# EAGLE design I2CMux (EAGLE 7.4.0)
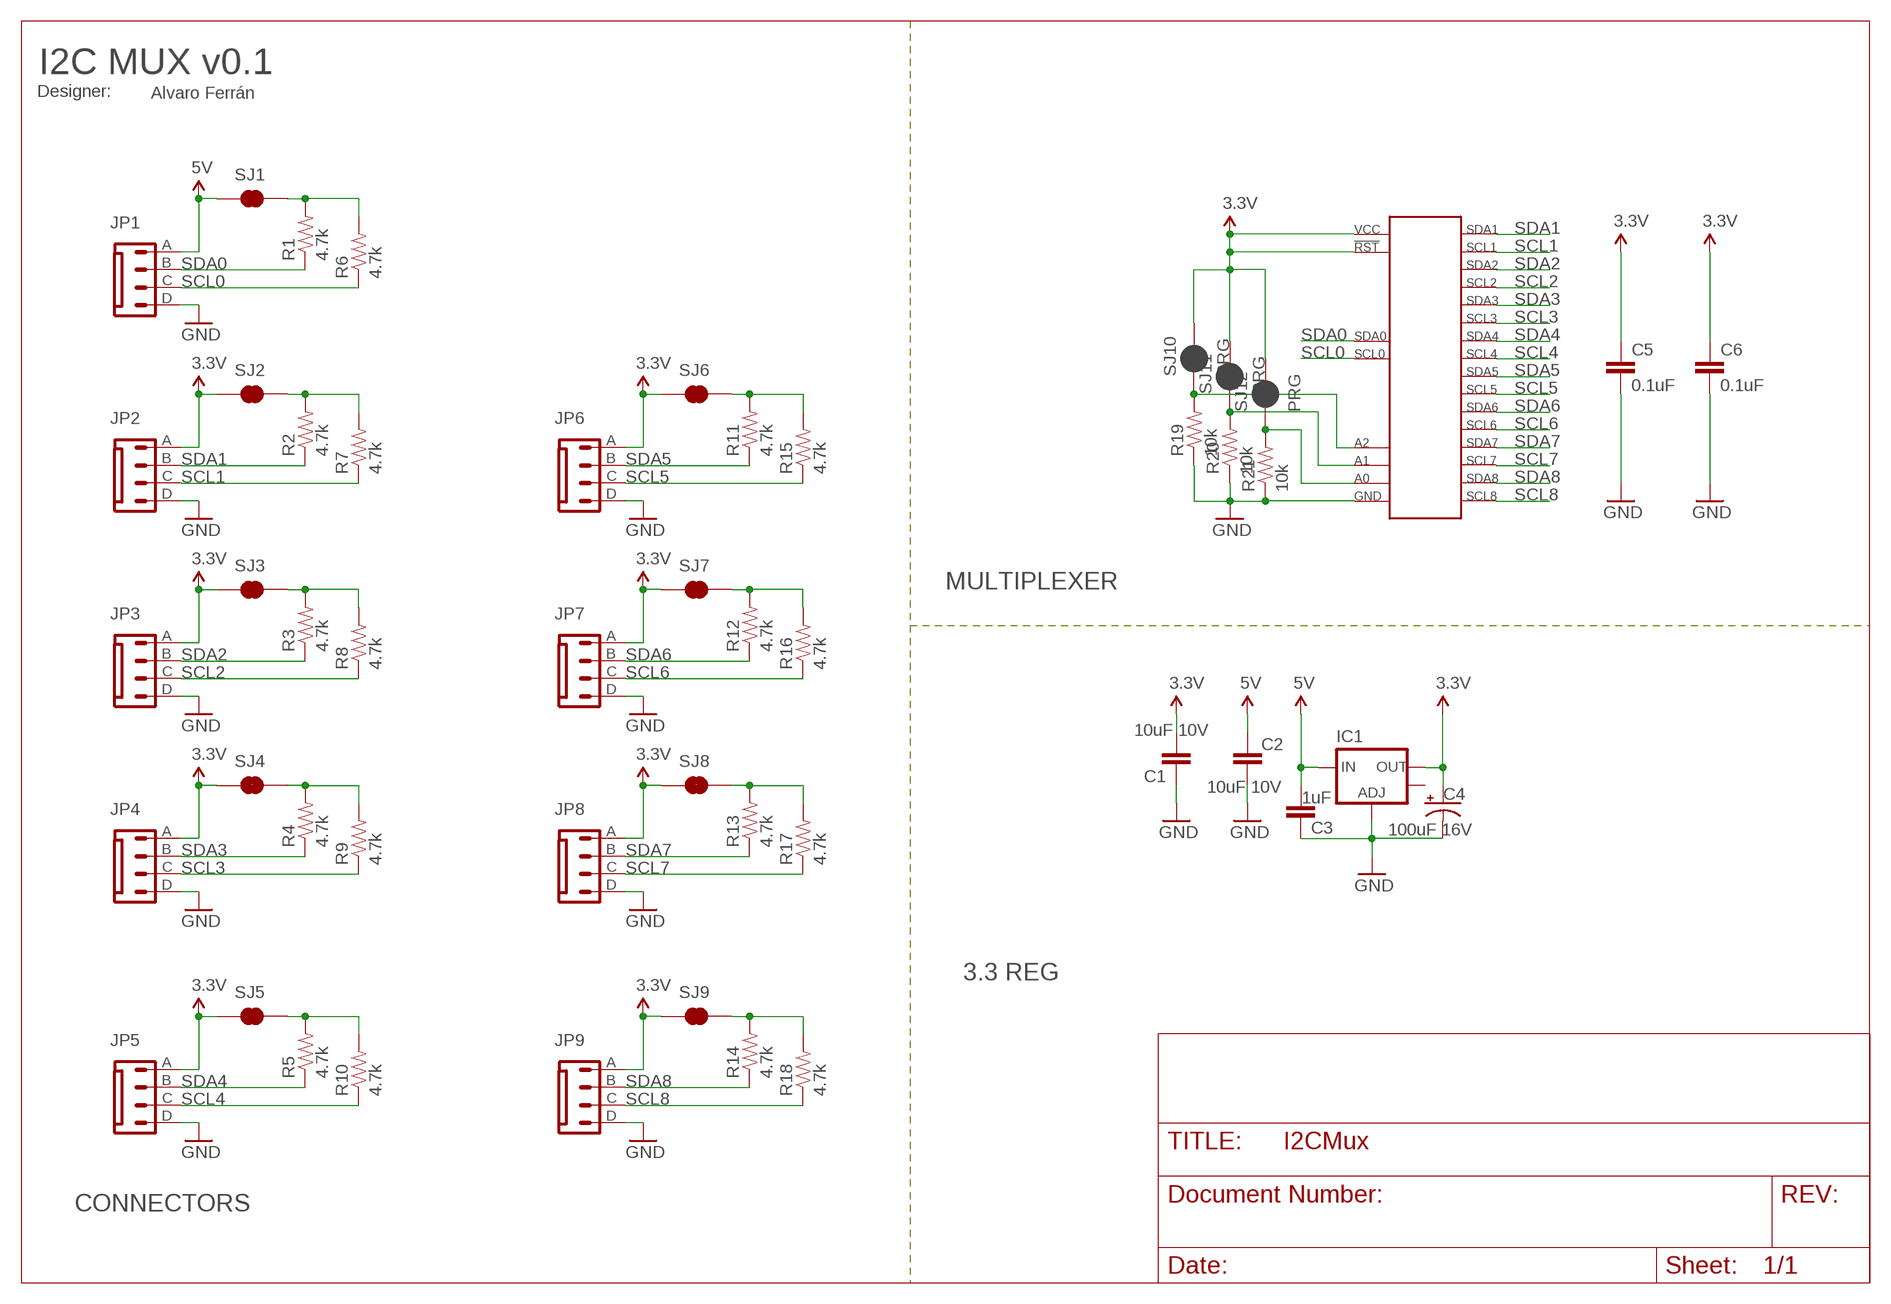
[diagram p0: schematic, sheet 1]

## Parts
C1  10uF 10V  CAP0402-CAP  [0402-CAP]
C2  10uF 10V  CAP0402-CAP  [0402-CAP]
C3  1uF  CAP0402-CAP  [0402-CAP]
C4  100uF 16V  CAP_POLC  [PANASONIC_C]
C5  0.1uF  CAP0402-CAP  [0402-CAP]
C6  0.1uF  CAP0402-CAP  [0402-CAP]
IC1  V_REG_LM1117SOT223  [SOT223]
IC2  PCA9548A  [PCA9548ABS]
JP1  MX-6410-04A  [MX-6410-04A]
JP2  MX-6410-04A  [MX-6410-04A]
JP3  MX-6410-04A  [MX-6410-04A]
JP4  MX-6410-04A  [MX-6410-04A]
JP5  MX-6410-04A  [MX-6410-04A]
JP6  MX-6410-04A  [MX-6410-04A]
JP7  MX-6410-04A  [MX-6410-04A]
JP8  MX-6410-04A  [MX-6410-04A]
JP9  MX-6410-04A  [MX-6410-04A]
R1  4.7k  RESISTOR0402-RES  [0402-RES]
R2  4.7k  RESISTOR0402-RES  [0402-RES]
R3  4.7k  RESISTOR0402-RES  [0402-RES]
R4  4.7k  RESISTOR0402-RES  [0402-RES]
R5  4.7k  RESISTOR0402-RES  [0402-RES]
R6  4.7k  RESISTOR0402-RES  [0402-RES]
R7  4.7k  RESISTOR0402-RES  [0402-RES]
R8  4.7k  RESISTOR0402-RES  [0402-RES]
R9  4.7k  RESISTOR0402-RES  [0402-RES]
R10  4.7k  RESISTOR0402-RES  [0402-RES]
R11  4.7k  RESISTOR0402-RES  [0402-RES]
R12  4.7k  RESISTOR0402-RES  [0402-RES]
R13  4.7k  RESISTOR0402-RES  [0402-RES]
R14  4.7k  RESISTOR0402-RES  [0402-RES]
R15  4.7k  RESISTOR0402-RES  [0402-RES]
R16  4.7k  RESISTOR0402-RES  [0402-RES]
R17  4.7k  RESISTOR0402-RES  [0402-RES]
R18  4.7k  RESISTOR0402-RES  [0402-RES]
R19  10k  RESISTOR0402-RES  [0402-RES]
R20  10k  RESISTOR0402-RES  [0402-RES]
R21  10k  RESISTOR0402-RES  [0402-RES]
SJ1  JUMPER-PAD-2-NC_BY_TRACE  [PAD-JUMPER-2-NC_BY_TRACE_YES_SILK]
SJ2  JUMPER-PAD-2-NC_BY_TRACE  [PAD-JUMPER-2-NC_BY_TRACE_YES_SILK]
SJ3  JUMPER-PAD-2-NC_BY_TRACE  [PAD-JUMPER-2-NC_BY_TRACE_YES_SILK]
SJ4  JUMPER-PAD-2-NC_BY_TRACE  [PAD-JUMPER-2-NC_BY_TRACE_YES_SILK]
SJ5  JUMPER-PAD-2-NC_BY_TRACE  [PAD-JUMPER-2-NC_BY_TRACE_YES_SILK]
SJ6  JUMPER-PAD-2-NC_BY_TRACE  [PAD-JUMPER-2-NC_BY_TRACE_YES_SILK]
SJ7  JUMPER-PAD-2-NC_BY_TRACE  [PAD-JUMPER-2-NC_BY_TRACE_YES_SILK]
SJ8  JUMPER-PAD-2-NC_BY_TRACE  [PAD-JUMPER-2-NC_BY_TRACE_YES_SILK]
SJ9  JUMPER-PAD-2-NC_BY_TRACE  [PAD-JUMPER-2-NC_BY_TRACE_YES_SILK]
SJ10  PRG  JUMPER-PAD-2-NC_BY_PASTE  [PAD-JUMPER-2-NC_BY_PASTE_YES_SILK]
SJ11  PRG  JUMPER-PAD-2-NC_BY_PASTE  [PAD-JUMPER-2-NC_BY_PASTE_YES_SILK]
SJ12  PRG  JUMPER-PAD-2-NC_BY_PASTE  [PAD-JUMPER-2-NC_BY_PASTE_YES_SILK]

## Nets
3.3V [power]: C1.2 C4.+ C5.1 C6.1 IC1.2(OUT) IC2.21(VCC) IC2.24(!RESET) JP2.A JP3.A JP4.A JP5.A JP6.A JP7.A JP8.A JP9.A SJ2.1 SJ3.1 SJ4.1 SJ5.1 SJ6.1 SJ7.1 SJ8.1 SJ9.1 SJ10.2 SJ11.2 SJ12.2
5V: C2.2 C3.2 IC1.3(IN) JP1.A SJ1.1
A0: IC2.22(A0) R21.2 SJ12.1
A1: IC2.23(A1) R20.2 SJ11.1
A2: IC2.18(A2) R19.2 SJ10.1
GND: C1.1 C2.1 C3.1 C4.- C5.2 C6.2 IC1.1(ADJ) IC2.9(GND) IC2.THERMAL(GND) JP1.D JP2.D JP3.D JP4.D JP5.D JP6.D JP7.D JP8.D JP9.D R19.1 R20.1 R21.1
N$2: R1.2 R6.2 SJ1.2
N$5 [power]: R2.2 R7.2 SJ2.2
N$6 [power]: R3.2 R8.2 SJ3.2
N$7 [power]: R4.2 R9.2 SJ4.2
N$8 [power]: R5.2 R10.2 SJ5.2
N$9 [power]: R14.2 R18.2 SJ9.2
N$10 [power]: R13.2 R17.2 SJ8.2
N$11 [power]: R12.2 R16.2 SJ7.2
N$12 [power]: R11.2 R15.2 SJ6.2
SCL0: IC2.19(SCL0) JP1.C R6.1
SCL1: IC2.2(SCL1) JP2.C R7.1
SCL2: IC2.4(SCL2) JP3.C R8.1
SCL3: IC2.6(SCL3) JP4.C R9.1
SCL4: IC2.8(SCL4) JP5.C R10.1
SCL5: IC2.11(SCL5) JP6.C R15.1
SCL6: IC2.13(SCL6) JP7.C R16.1
SCL7: IC2.15(SCL7) JP8.C R17.1
SCL8: IC2.17(SCL8) JP9.C R18.1
SDA0: IC2.20(SDA0) JP1.B R1.1
SDA1: IC2.1(SDA1) JP2.B R2.1
SDA2: IC2.3(SDA2) JP3.B R3.1
SDA3: IC2.5(SDA3) JP4.B R4.1
SDA4: IC2.7(SDA4) JP5.B R5.1
SDA5: IC2.10(SDA5) JP6.B R11.1
SDA6: IC2.12(SDA6) JP7.B R12.1
SDA7: IC2.14(SDA7) JP8.B R13.1
SDA8: IC2.16(SDA8) JP9.B R14.1
Unconnected: IC1.4(OUT)

## Notes on the sheet
- I2C MUX v0.1
- Designer: | Alvaro Ferrán
- MULTIPLEXER
- 3.3 REG
- CONNECTORS

## Library data of the parts
C1-C3 C5 C6 = SparkFun-Passives:CAP: Capacitor Standard 0603 ceramic capacitor, and 0.1" leaded capacitor.
C4 = SparkFun-Capacitors:CAP_POL: Capacitor Polarized These are standard SMD and PTH capacitors. Normally 10uF, 47uF, and 100uF in electrolytic and tantalum varieties. Always verify the external diameter of the through hole cap, it varies with capacity, voltage, and manufacturer. The EIA devices should be standard.
IC1 = SparkFun-PowerIC:V_REG_LM1117: Voltage Regulator LM1117 Standard adjustable voltage regulator but in SMD form. Spark Fun Electronics SKU : COM-00595; PROD_ID: VREG-08170
IC2 = alvaroferran:PCA9548A: 8-channel I2C-bus switch multiplexer with reset
JP1-JP9 = alvaroferran:MX-6410-04A: Locking molex connector ( http://www.tme.eu/en/details/mx-6410-04a/raster-signal-connectors-254mm/molex/0022272041-ae-6410-04a102/ )
R1-R21 = SparkFun-Passives:RESISTOR: Resistor Basic schematic elements and footprints for 0603, 1206, and PTH resistors.
SJ1-SJ9 = SparkFun-Passives:JUMPER-PAD-2-NC_BY_TRACE
SJ10-SJ12 = SparkFun-Passives:JUMPER-PAD-2-NC_BY_PASTE

## Net classes
0 default: width 0.254 mm, drill 0.254 mm, clearance 0.203 mm
1 power: width 0.61 mm, drill 0.61 mm, clearance 0.254 mm
2 gnd: width 0.305 mm, drill 0.559 mm, clearance 0.254 mm

## Board
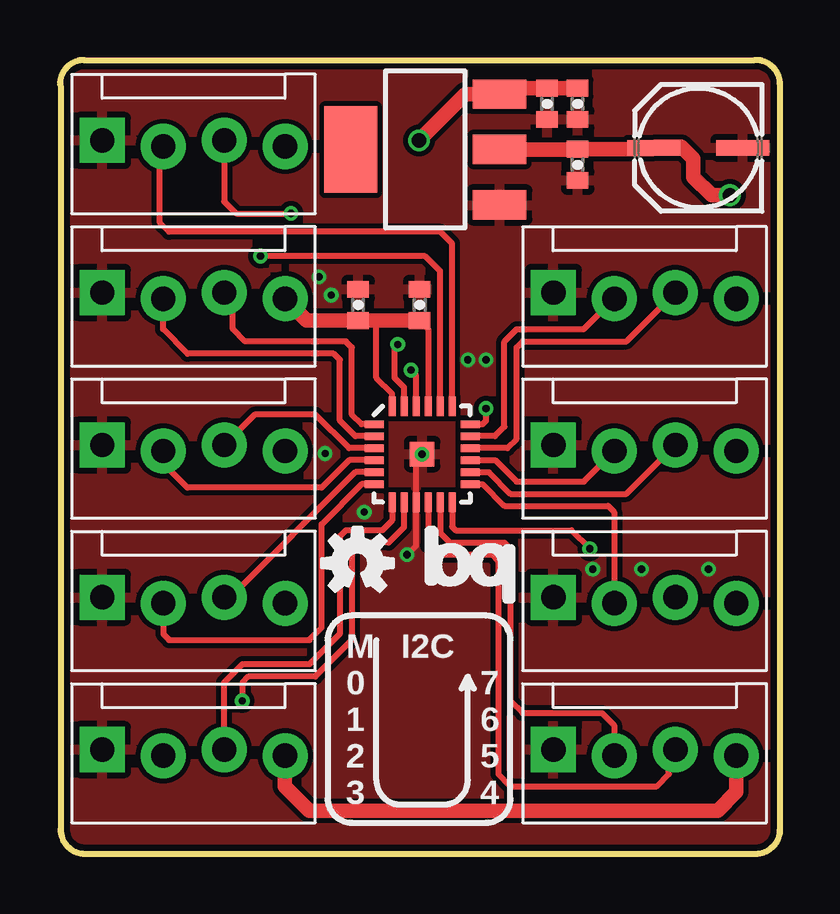
[diagram p1: board, top side]
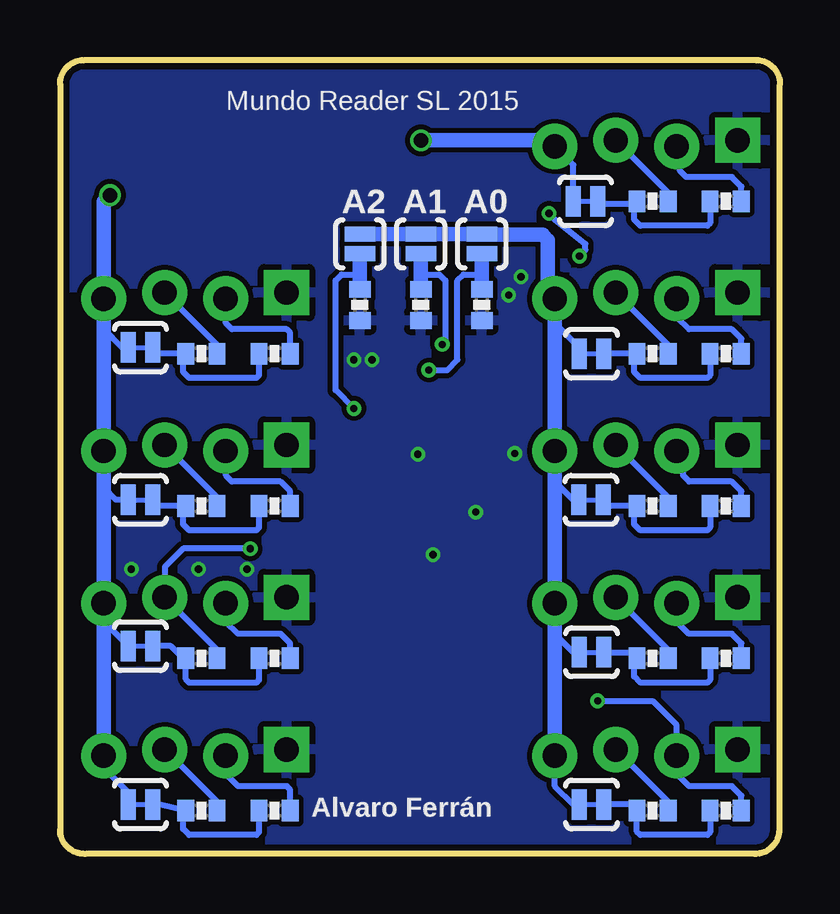
[diagram p2: board, bottom side, seen from below]

Size 30 x 33.1 mm. Coordinates in mm from the lower left corner, seen from the top.
Outline: 1.02,33.1 arc90 0,32.08
Outline: 30,32.08 arc90 28.98,33.1
Outline: 0.03,1.02 arc90 1.04,0
Outline: 28.98,0 arc90 30,1.02
Outline: 0.99,33.1 28.93,33.1
Outline: 0.03,32.03 0.03,1.04
Outline: 0.99,0 28.93,0
Outline: 30,32.11 30,0.86
Copper layers (1*16): Top 0.035mm / dielectric 1.5mm / Bottom 0.035mm
Design rules "pighixxx_CAM_DRC_V1.0": minimum track width 6mil, minimum drill 12mil, track to track 6mil, track to pad 6mil, pad to pad 6mil, via to via 6mil, smd to smd 0mil, copper to edge 10mil, drill to drill 10mil, minimum pad ring 10mil, minimum via ring 6mil, stop-mask expansion 2mil, vias tented up to drill 100mil, thermal gap 10mil

### Footprints (pad centres in the part's own frame; a part is rotated, then mirrored left to right if it is on the bottom)
0402-CAP = smd 0.7 x 0.9: 1 -0.65,0; 2 0.65,0
PANASONIC_C = smd 2.2 x 0.65: + 1.9,-0.2; - -1.8,-0.2
SOT223 = smd 1.219 x 2.235: 1 -2.311,-3.099; 2 0,-3.099; 3 2.311,-3.099 | smd 3.6 x 2.2: 4 0,3.099
PCA9548ABS = smd 0.8 x 0.3: 1 -2,1.25; 2 -2,0.75; 3 -2,0.25; 4 -2,-0.25; 5 -2,-0.75; 6 -2,-1.25; 13 2,-1.25; 14 2,-0.75; 15 2,-0.25; 16 2,0.25; 17 2,0.75; 18 2,1.25 | smd 0.3 x 0.8: 7 -1.25,-2; 8 -0.75,-2; 9 -0.25,-2; 10 0.25,-2; 11 0.75,-2; 12 1.25,-2; 19 1.25,2; 20 0.75,2; 21 0.25,2; 22 -0.25,2; 23 -0.75,2; 24 -1.25,2 | smd 1.016 x 1.016: THERMAL 0,0
MX-6410-04A = drill 1.016 pad 1.88: A 8.9,2.797; B 6.36,3.051; C 3.82,2.797 | drill 1.016 pad 1.88 square: D 1.28,3.051
0402-RES = smd 0.7 x 0.9: 1 -0.65,0; 2 0.65,0
PAD-JUMPER-2-NC_BY_TRACE_YES_SILK = smd 0.635 x 1.27: 1 -0.508,0; 2 0.508,0
PAD-JUMPER-2-NC_BY_PASTE_YES_SILK = smd 0.635 x 1.27: 1 -0.401,0; 2 0.413,0

### Placement (x,y rotation side)
C1  21.56,28.73 90 top
C2  21.56,31.27 90 top
C3  20.29,31.27 90 top
C4  26.64,29.24 180 top
C5  12.42,22.89 90 top
C6  14.99,22.89 90 top
IC1  15.21,29.36 90 top
IC2  15.09,16.66 0 top
JP1  0.48,26.7 0 top
JP2  0.48,20.35 0 top
JP3  0.48,14 0 top
JP4  0.48,7.65 0 top
JP5  0.48,1.3 0 top
JP6  19.28,1.3 0 top
JP7  19.28,7.65 0 top
JP8  19.28,14 0 top
JP9  19.28,20.35 0 top
LOGO3  OSHW-LOGOS  [OSHW-LOGO-S]  12.4,12.12 0 top
R1  5.31,27.2 180 bottom
R2  5.31,20.85 180 bottom
R3  5.31,14.5 180 bottom
R4  5.31,8.15 180 bottom
R5  5.31,1.8 180 bottom
R6  2.26,27.2 180 bottom
R7  2.26,20.85 180 bottom
R8  2.26,14.5 180 bottom
R9  2.26,8.15 180 bottom
R10  2.26,1.8 180 bottom
R11  24.1,1.8 180 bottom
R12  24.1,8.15 180 bottom
R13  24.1,14.5 180 bottom
R14  24.1,20.85 180 bottom
R15  21.06,1.8 180 bottom
R16  21.06,8.15 180 bottom
R17  21.06,14.5 180 bottom
R18  21.06,20.85 180 bottom
R19  17.5,22.89 90 bottom
R20  14.96,22.89 90 bottom
R21  12.42,22.89 90 bottom
SJ1  8.1,27.2 0 bottom
SJ2  7.85,20.85 0 bottom
SJ3  7.87,14.76 0 bottom
SJ4  7.85,8.41 0 bottom
SJ5  7.85,2.06 0 bottom
SJ6  26.64,2.06 0 bottom
SJ7  26.64,8.66 0 bottom
SJ8  26.64,14.76 0 bottom
SJ9  26.64,21.11 0 bottom
SJ10  17.5,25.43 90 bottom
SJ11  14.96,25.43 90 bottom
SJ12  12.42,25.43 90 bottom
U$2  [BQ_LOGO_MEDIUM]  15.21,10.44 0 top

### Tracks (layer width: path | path; a pad name or v marks a point on that pad's centre or on a via)
3.3V  (via drill 0.61)
  Top 0.254: IC2.21 15.34,21.88 C6.1 | IC2.24 13.84,19.18 13.18,19.84 13.18,22.24
  Top 0.61: JP5.A 9.37,4.08 9.37,2.82 10.39,1.8 27.41,1.8 28.18,2.58 JP6.A | JP2.A 10.29,22.24 C5.1 13.18,22.24 C6.1 | IC1.2 21.55,29.36 C1.2 24.69,29.38 C4.+ 24.8,29.49 25.88,29.49 26.39,28.98 26.39,28.22 27.15,27.46 v27.91,27.46
  Bottom 0.254: SJ3.1 8.62,14.76 9.38,15.52 | SJ2.1 8.37,21.11 9.38,22.12 | SJ4.1 8.62,8.41 9.38,9.17 | SJ5.1 8.61,2.06 9.37,2.82 9.37,4.08 JP5.A | SJ6.1 27.15,2.56 28.18,3.58 JP6.A | SJ7.1 28.18,9.69 28.18,9.93 | SJ9.1 27.42,21.11 28.18,21.87 | SJ8.1 27.67,14.76 28.18,15.27
  Bottom 0.61: JP5.A 9.38,9.17 JP4.A 9.38,15.52 JP3.A 9.38,22.12 JP2.A 9.67,23.43 9.67,25.59 9.88,25.81 12.39,25.81 SJ12.2 SJ11.2 SJ10.2 | JP6.A 28.18,9.93 JP7.A 28.18,15.27 JP8.A 28.18,21.87 JP9.A 28.18,27.19 v27.91,27.46
5V  (via drill 0.6)
  Top 0.61: C2.2 C3.2 18.56,31.92 IC1.3 16.89,31.67 v14.96,29.74
  Bottom 0.254: SJ1.1 8.61,28.72 JP1.A
  Bottom 0.61: JP1.A 9.63,29.74 v14.96,29.74
A0  (via drill 0.3)
  Top 0.254: IC2.22 14.84,19.96 v14.63,20.17
  Bottom 0.254: 14.71,20.09 v14.63,20.17 13.87,20.17 13.44,20.6 13.44,23.9 13.18,24.16 12.42,24.16
  Bottom 0.61: R21.2 12.42,24.16 SJ12.1
A1  (via drill 0.3)
  Top 0.254: IC2.23 14.34,19.44 13.94,19.84 13.94,21.11 v14.07,21.23
  Bottom 0.254: 14.96,24.16 14.2,24.16 13.94,23.9 13.94,21.36 v14.07,21.23
  Bottom 0.61: R20.2 14.96,24.16 SJ11.1
A2  (via drill 0.3)
  Top 0.254: IC2.18 17.61,17.91 17.75,18.06 v17.75,18.57
  Bottom 0.254: v17.75,18.57 18.52,19.33 18.52,23.9 18.26,24.16 17.5,24.16
  Bottom 0.61: R19.2 17.5,24.16 SJ10.1
GND  (via drill 0.3)
  Top 0.254: v14.45,12.47 14.84,12.86 IC2.9 14.84,16.41 IC2.THERMAL
  other vias: 12.67,14.25 11.05,16.69 15.09,16.66 10.79,24.05 11.3,23.29 16.99,20.6 17.75,20.6 22.2,11.86 24.23,11.86 27.03,11.86
  pour Top: 0,33.1 30,33.1 30,-0.2 0,-0.2
  pour Bottom: 0,33.1 30,33.1 30,0.05 0,0.05
N$2
  Bottom 0.254: 6.07,27.09 7.48,27.09 SJ1.2 | R6.2 2.91,26.3 3.02,26.19 5.82,26.19 6.07,26.44 6.07,27.09 | 6.07,27.09 R1.2
N$5
  Bottom 0.254: 2.91,20.46 R7.2 2.91,19.95 3.02,19.84 5.82,19.84 6.07,20.09 6.07,20.74 R2.2 SJ2.2
N$6
  Bottom 0.254: SJ3.2 7.11,14.5 R3.2 6.07,14.39 6.07,13.74 5.82,13.49 3.02,13.49 2.91,13.6 R8.2
N$7
  Bottom 0.254: SJ4.2 6.21,8.41 R4.2 6.07,8.04 6.07,7.39 5.82,7.14 3.02,7.14 2.91,7.25 R9.2
N$8
  Bottom 0.254: 6.07,1.69 R5.2 | R5.2 6.07,1.95 6.18,2.06 SJ5.2 | R10.2 2.91,0.9 3.02,0.79 5.82,0.79 5.96,0.93 R5.2
N$9
  Bottom 0.254: R18.2 21.71,19.95 21.82,19.84 24.61,19.84 24.87,20.09 24.87,20.74 R14.2 25.88,20.85 SJ9.2
N$10
  Bottom 0.254: R17.2 21.71,13.6 21.82,13.49 24.61,13.49 24.87,13.74 24.87,14.39 R13.2 25.88,14.5 SJ8.2
N$11
  Bottom 0.254: R16.2 21.71,7.25 21.82,7.14 24.61,7.14 24.75,7.28 R12.2 24.87,8.15 25.37,8.66 SJ7.2
N$12
  Bottom 0.254: SJ6.2 25.88,2.06 R11.2 24.87,1.69 24.87,1.04 24.61,0.79 21.82,0.79 21.71,0.9 R15.2
SCL0
  Top 0.254: IC2.19 16.34,25.45 15.85,25.93 4.55,25.93 4.17,26.31 4.17,29.36 JP1.C
  Bottom 0.254: R6.1 1.61,27.82 2.01,28.22 3.91,28.22 4.17,28.47 4.17,29.36 JP1.C
SCL1
  Top 0.254: IC2.2 12.31,17.41 11.66,18.06 11.66,20.6 11.4,20.85 5.31,20.85 4.29,21.87 4.29,23.13 JP2.C
  Bottom 0.254: R7.1 1.61,21.47 2.01,21.87 3.78,21.87 4.29,22.38 4.29,23.13 JP2.C
SCL2
  Top 0.254: IC2.4 12.04,16.41 10.9,15.27 5.31,15.27 4.29,16.28 4.29,16.78 JP3.C
  Bottom 0.254: R8.1 1.61,15.12 2.01,15.52 3.78,15.52 4.04,15.77 4.04,16.53 JP3.C
SCL3
  Top 0.254: JP4.C 4.3,9.16 4.55,8.92 10.39,8.92 10.9,9.42 10.9,13.74 12.57,15.41 IC2.6
  Bottom 0.254: R9.1 1.61,8.77 2.01,9.17 3.79,9.17 4.3,9.68 JP4.C
SCL4  (via drill 0.3)
  Top 0.254: v7.59,6.38 7.59,7.14 7.85,7.39 10.64,7.39 12.17,8.92 12.17,12.73 12.42,12.98 13.69,12.98 14.34,13.63 IC2.8
  Bottom 0.254: v7.59,6.38 5.31,6.38 4.3,5.37 JP5.C 4.29,4.08 4.29,3.33 3.78,2.82 2.01,2.82 1.61,2.42 R10.1
SCL5
  Top 0.254: JP6.C 23.09,4.1 23.09,5.36 22.58,5.87 19.28,5.87 18.77,6.38 18.77,12.73 18.52,12.98 16.23,12.98 15.84,13.37 IC2.11
  Bottom 0.254: R15.1 20.41,2.68 20.55,2.82 22.58,2.82 23.09,3.33 23.09,4.08 JP6.C
SCL6
  Top 0.254: IC2.13 17.61,15.41 18.52,14.5 22.83,14.5 23.09,14.25 23.09,10.45 JP7.C
  Bottom 0.254: R16.1 20.41,8.77 20.8,9.17 22.58,9.17 23.09,9.68 23.09,10.43 JP7.C
SCL7
  Top 0.254: IC2.15 18.13,16.41 19.02,15.52 21.83,15.52 JP8.C
  Bottom 0.254: R17.1 20.41,15.12 20.8,15.52 22.83,15.52 23.09,15.77 23.09,16.78 JP8.C
SCL8
  Top 0.254: IC2.17 18.12,17.41 18.52,17.81 18.52,21.36 19.02,21.87 21.82,21.87 JP9.C
  Bottom 0.254: R18.1 20.41,21.73 20.55,21.87 22.83,21.87 23.09,22.12 23.09,23.13 JP9.C
SDA0  (via drill 0.3)
  Top 0.254: IC2.20 15.84,24.29 15.21,24.92 v8.36,24.92 | JP1.B 6.84,27.19 7.34,26.7 v9.63,26.7
  Bottom 0.254: v8.36,24.92 8.1,25.17 8.1,25.43 9.37,26.44 v9.63,26.7 | R1.1 4.66,27.56 JP1.B
SDA1
  Top 0.254: IC2.1 12.57,17.91 12.17,18.31 12.17,21.11 11.91,21.36 7.71,21.36 7.2,21.87 7.2,23.04 JP2.B
  Bottom 0.254: R2.1 4.66,21.21 JP2.B
  Bottom 0.305: 7.2,23.04 JP2.B
SDA2
  Top 0.254: IC2.3 12.04,16.91 10.64,18.31 8.11,18.31 JP3.B
  Bottom 0.254: R3.1 4.66,14.86 JP3.B
SDA3
  Top 0.254: IC2.5 12.31,15.91 7.09,10.7 JP4.B
  Bottom 0.254: R4.1 4.66,8.51 JP4.B
SDA4
  Top 0.254: IC2.7 13.84,13.89 13.44,13.49 11.91,13.49 11.66,13.23 11.66,9.17 10.39,7.9 7.59,7.9 6.83,7.14 6.83,4.36 JP5.B
  Bottom 0.254: R5.1 4.66,2.16 JP5.B
SDA5
  Top 0.254: IC2.10 15.34,12.86 15.72,12.47 18.01,12.47 18.26,12.22 18.26,3.33 18.77,2.82 24.87,2.82 25.37,3.33 25.37,4.08 JP6.B
  Bottom 0.254: R11.1 23.45,2.16 JP6.B
SDA6  (via drill 0.3)
  Top 0.254: IC2.12 16.34,13.63 16.48,13.49 21.31,13.49 v22.07,12.73
  Bottom 0.254: R12.1 23.45,8.51 JP7.B 25.63,10.71 25.63,11.96 24.87,12.73 v22.07,12.73
SDA7
  Top 0.254: IC2.14 17.87,15.91 18.77,15.01 23.6,15.01 JP8.B
  Bottom 0.254: R13.1 23.45,14.86 JP8.B
SDA8
  Top 0.254: IC2.16 18.64,16.91 19.02,17.3 19.02,21.11 19.28,21.36 23.6,21.36 JP9.B
  Bottom 0.254: R14.1 23.45,21.21 JP9.B

### Text on the board
tPlace: M | I2C | 0 | 7 | 1 | 6 | 2 | 5 | 3 | 4
bPlace: Mundo Reader SL 2015 | A0 | A1 | A2 | Alvaro Ferrán